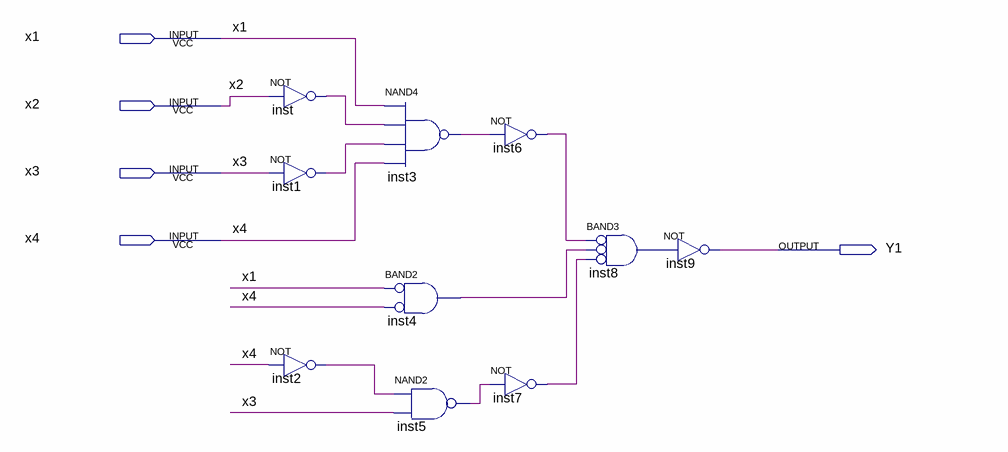
[diagram p0: schematic sheet]
// Quartus schematic Lab1.bdf as structural Verilog: 10 symbols, 5 pins
module Lab1 (
  input  x1,
  input  x2,
  input  x3,
  input  x4,
  output Y1
);

  wire inst1_out, inst2_out, inst3_out, inst4_out, inst5_out, inst6_out, inst7_out, inst8_out, inst_out;

  not inst (inst_out, x2);
  not inst1 (inst1_out, x3);
  not inst2 (inst2_out, x4);
  nand inst3 (inst3_out, x1, inst_out, inst1_out, x4);
  and inst4 (inst4_out, ~x1, ~x4);  // BAND2
  nand inst5 (inst5_out, inst2_out, x3);
  not inst6 (inst6_out, inst3_out);
  not inst7 (inst7_out, inst5_out);
  and inst8 (inst8_out, ~inst6_out, ~inst4_out, ~inst7_out);  // BAND3
  not inst9 (Y1, inst8_out);
endmodule
